# Altium schematic sheet ReboostV2_toplevel.SchDoc: ReboostV2 Top Sheet
size 420 x 297 mm; SheetNumber: 1
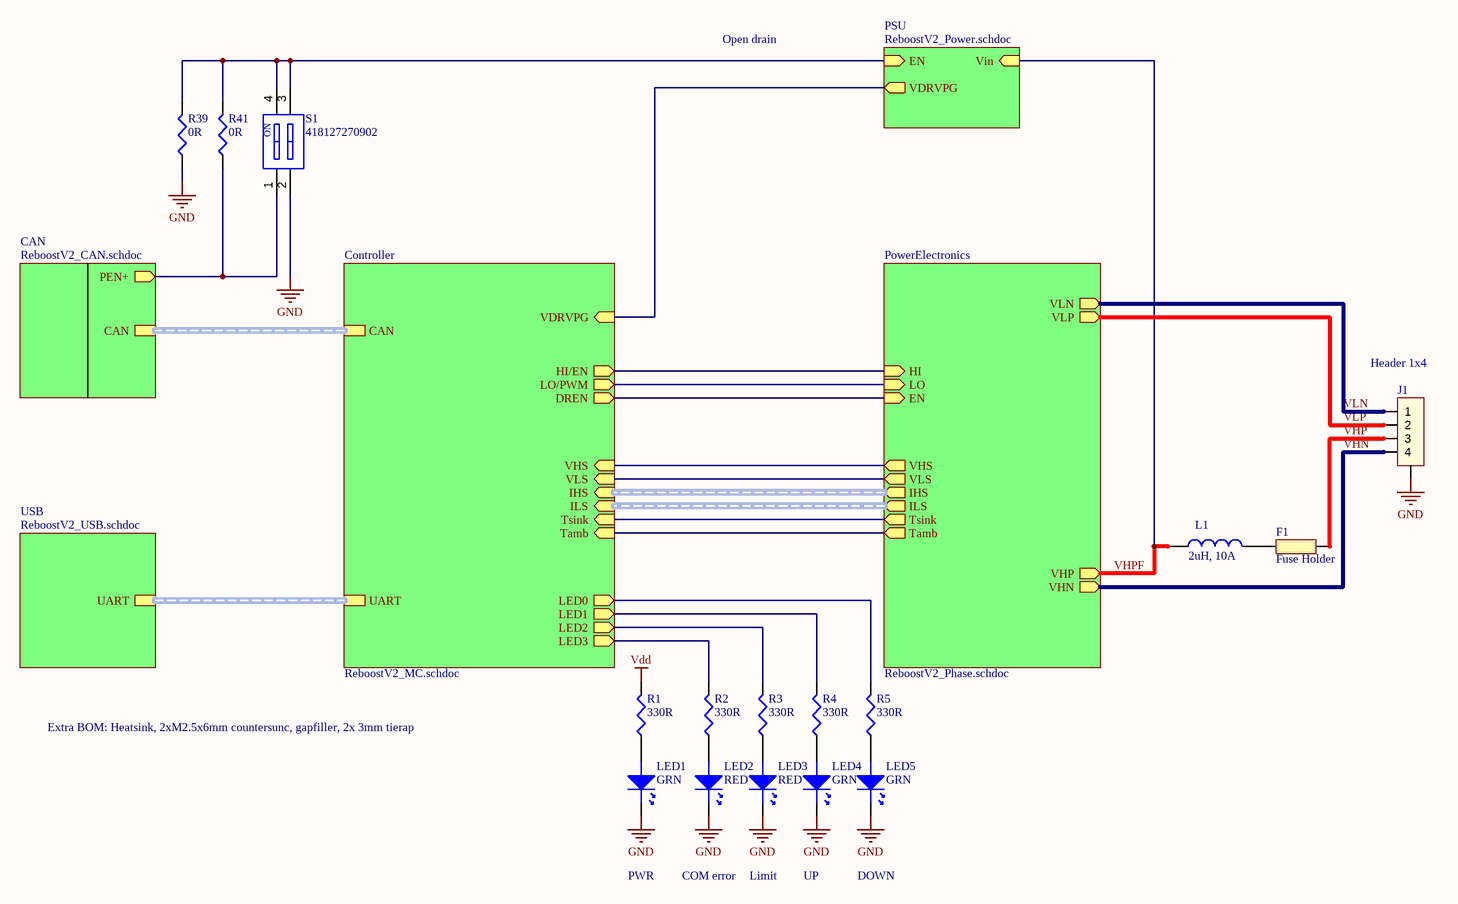
[diagram p0: ReboostV2_toplevel.SchDoc]

## Parts
F1  Fuse Holder  [Fuse5x20TH]
J1  Header 1x4  [PC 4/ 4-G-7,62]
L1  2uH, 10A  [744710210]
LED1  GRN  [WL-SMRW_1206 cylindrical_Reverse use]
LED2  RED  [WL-SMRW_1206 cylindrical_Reverse use]
LED3  RED  [WL-SMRW_1206 cylindrical_Reverse use]
LED4  GRN  [WL-SMRW_1206 cylindrical_Reverse use]
LED5  GRN  [WL-SMRW_1206 cylindrical_Reverse use]
R1  330R  [0603]
R2  330R  [0603]
R3  330R  [0603]
R4  330R  [0603]
R5  330R  [0603]
R39  0R  [0603]
R41  0R  [0603]
S1  418127270902  [418127270902]

## Sub-sheets
CAN = ReboostV2_CAN.schdoc: CAN, PEN+ (out)
Controller = ReboostV2_MC.schdoc: CAN (harness CAN), HI/EN (out), LO/PWM (out), UART (harness UART), LED1 (out), LED2 (out), LED3 (out), LED0 (out), VHS (in), VLS (in), Tsink (in), IHS (in, harness DP), ILS (in, harness DP), Tamb (in), DREN (out), VDRVPG (in)
PowerElectronics = ReboostV2_Phase.schdoc: VLP (out), VHP (out), Tsink (out), IHS (out), VHS (out), ILS (out), VLS (out), VHN (out), VLN (out), Tamb (out), HI (in), LO (in), EN (in)
PSU = ReboostV2_Power.schdoc: Vin (in), EN (in), VDRVPG (out)
USB = ReboostV2_USB.schdoc: UART (harness SERIAL)

## Nets
GND: J1.0 LED1.1(K) LED2.1(K) LED3.1(K) LED4.1(K) LED5.1(K) R39.1 S1.2
Vdd: R1.2
VHN: J1.4 ; sheet PowerElectronics/VHN
VHP: F1.2 J1.3
VHPF: L1.1 ; sheet PowerElectronics/VHP, sheet PSU/Vin
VLN: J1.1 ; sheet PowerElectronics/VLN
VLP: J1.2 ; sheet PowerElectronics/VLP
NetF1_1: F1.1 L1.2
NetLED1_2: LED1.2(A) R1.1
NetLED2_2: LED2.2(A) R2.1
NetLED3_2: LED3.2(A) R3.1
NetLED4_2: LED4.2(A) R4.1
NetLED5_2: LED5.2(A) R5.1
NetR2_2: R2.2 ; sheet Controller/LED3
NetR3_2: R3.2 ; sheet Controller/LED2
NetR4_2: R4.2 ; sheet Controller/LED1
NetR5_2: R5.2 ; sheet Controller/LED0
NetR39_2: R39.2 R41.2 S1.3 S1.4 ; sheet PSU/EN
NetR41_1: R41.1 S1.1 ; sheet CAN/PEN+
(unnamed): sheet Controller/HI/EN, sheet PowerElectronics/HI
(unnamed): sheet Controller/LO/PWM, sheet PowerElectronics/LO
(unnamed): sheet Controller/VHS, sheet PowerElectronics/VHS
(unnamed): sheet Controller/VLS, sheet PowerElectronics/VLS
(unnamed): sheet Controller/Tsink, sheet PowerElectronics/Tsink
(unnamed): sheet Controller/Tamb, sheet PowerElectronics/Tamb
(unnamed): sheet Controller/DREN, sheet PowerElectronics/EN
(unnamed): sheet Controller/VDRVPG, sheet PSU/VDRVPG

## Buses and harness runs
harness sheet CAN/CAN = sheet Controller/CAN
harness sheet Controller/IHS = sheet PowerElectronics/IHS
harness sheet Controller/ILS = sheet PowerElectronics/ILS
harness sheet Controller/UART = sheet USB/UART

## Notes on the sheet
- Open drain
- Extra BOM: Heatsink, 2xM2.5x6mm countersunc, gapfiller, 2x 3mm tierap
- PWR
- COM error
- Limit
- UP
- DOWN
- PROJECT
- www.tpee.nl <http://www.tpee.nl>
- TITLE
- FILE NAME
- A3
- SIZE
- Author:
- SHEET
- OF
- (in symbol 418127270902) ON

## Library data of the parts
F1 = 0031.8201: Fuse, Holder, 10A, 250V, T:-40°C +85°C; Brand: SCHURTER; Price: 0,43; Order Code Supplier: 1162740; Brand Number: 0031.8201; Supplier: Farnell; Manufacturer: SCHURTER; Manufacturer Part Number: 0031.8201
J1 = PC 4/4-G-7,62_1: Header, Close Horizontal, 1x4, Male, 7.62mm, TH; Manufacturer: PHOENIX CONTACT; Manufacturer Part Number: 1804810; Case Style: *; Order Code Supplier: 1792930; Pitch: 7.62mm; Price: 2,92; Supplier: Farnell; MPN: PC 4/4-G-7,62
L1 = 744710210: WE-SD Rod Core Choke, 2uH, 10A; Manufacturer: Wurth Elektronik; DC Resistance: 3.8mOhm; ComponentLink1Description: Manufacturer; ComponentLink1URL: http://www.we-online.de; ComponentLink2Description: Datasheet; ComponentLink2URL: https://www.we-online.com/catalog/datasheet/744710210.pdf; Operating Temperature: -40 to +150degC; Packaging: Carton; Published Date: April 2020; Inductance: 2uH; Manufacturer Part Number: 744710210; Mounting Technology: THT; Rated Current: 10A
LED1 LED4 LED5 = 156120GS75300: LED, Reverse Mount, Cylindrical, Green; Manufacturer: Wurth Elektronik; Brand: Wurth; Order Code Supplier: 2322091; Supplier: Farnell; Price: 0,519; Brand Number: 156120GS75300; Manufacturer Part Number: 156120GS75300
LED2 LED3 = 156120RS75300: LED, Reverse Mount, Cylindrical, Red; Manufacturer: Wurth Elektronik; Brand: Wurth; Order Code Supplier: 2322094; Supplier: Farnell; Price: 0,519; Brand Number: 156120RS75300; Manufacturer Part Number: 156120RS75300
R1-R5 = 330/0603/0063W/50V: Resistor, 330R, 1%, 0.063W, 50V, 100PPM, 0603; Brand: VISHAY DRALORIC; Brand Number: CRCW0603330RFKEA; Case Style: 0603; Order Code Supplier: 2122302; Power Rating: 0.063W; Price: 0,038; Resistance: 330R; Supplier: Farnell; Temperature Coefficient: ± 100PPM; Temperature Range: -55°C to +125°C; Voltage Rating: 50V; Manufacturer: VISHAY DRALORIC; Manufacturer Part Number: CRCW0603330RFKEA
R39 R41 = 0/0603/0063W/50V: Resistor, 0R, 0.1%, 0.063W, 50V, 200PPM, 0603; Brand: VISHAY DRALORIC; Brand Number: CRCW06030000Z0EA; Case Style: 0603; Order Code Supplier: 2122112; Power Rating: 0.063W; Price: 0,043; Resistance: 0R; Supplier: Farnell; Temperature Coefficient: ± 200PPM; Temperature Range: -55°C to +125°C; Voltage Rating: 50V; Manufacturer: VISHAY DRALORIC; Manufacturer Part Number: CRCW06030000Z0EA
S1 = 418127270902: WS-DITV Small Compact THT Dip Switch, Raised Actuator, pitch 2.54mm, 2p; Manufacturer: Wurth Elektronik; Operation Force: 600g; Pole Number: 2; Actuator Type: Raise Type; Circuit: SPST-NO; Rated Current Switching: 25mA; Rated Current Non-Switching: 100mA; Rated Voltage Non-Switching: 50VDC; Rated Voltage Switching: 24VDC; ComponentLink1Description: Manufacturer; ComponentLink1URL: http://www.we-online.de; ComponentLink2Description: Datasheet; ComponentLink2URL: https://katalog.we-online.com/em/datasheet/418127270902.pdf; Pitch: 2.54mm; Contact Material: Copper Alloy; Mounting Technology: THT; Operating Temperature: -40 to +85degC; Contact Plating: Gold; Packaging: Tube; Part Number: 418127270902; Publisher: Wurth Elektronik; Published Date: September 2019; Manufacturer Part Number: 418127270902